# EAGLE design 3003_3pin_voltera (EAGLE 9.6.2)
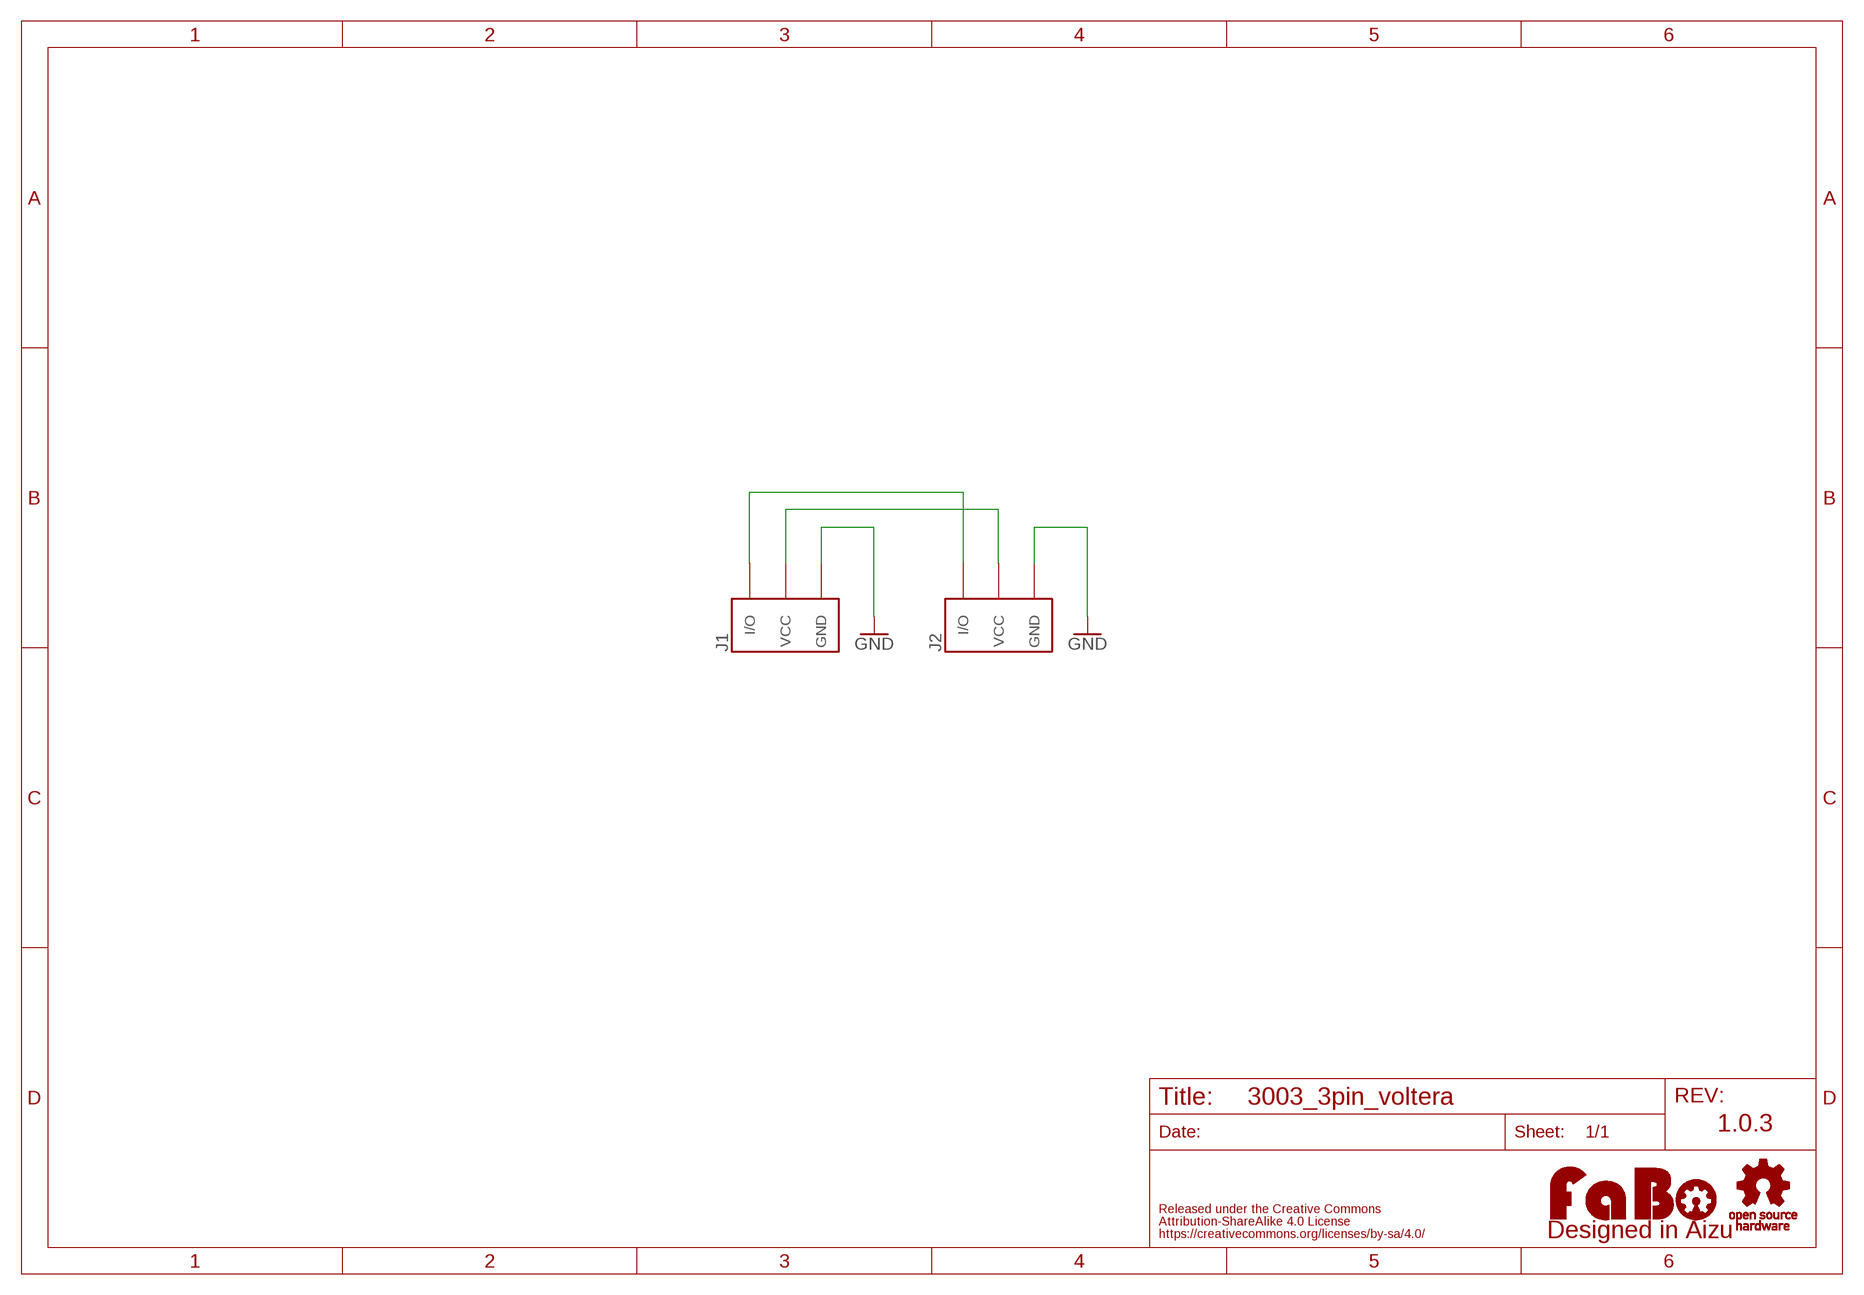
[diagram p0: schematic, sheet 1]

## Parts
J1  FABO_BRICK_3PIN-VOLTERA_BASE  [FABO_BRICK_3PIN_VOLTERA_BASE]
J2  FABO_BRICK_3PIN-VOLTERA_PAD  [FABO_BRICK_3PIN_VOLTERA_PAD]
U$3  LOGO_OSHW-M_BOTTOM  [LOGO_OSHW_M_BOTTOM]
U$4  LOGO_FABO-S  [LOGO_FABO_S]

## Nets
GND: J1.GND J2.GND
N$1: J1.VCC J2.VCC
N$2: J1.I/O J2.I/O

## Notes on the sheet
- 1.0.3

## Library data of the parts
J1 J2 = FaBo-Template:FABO_BRICK_3PIN: FaBo Brick 3pin
U$3 = FaBo-Logo:LOGO_OSHW
U$4 = FaBo-Logo:LOGO_FABO

## Board
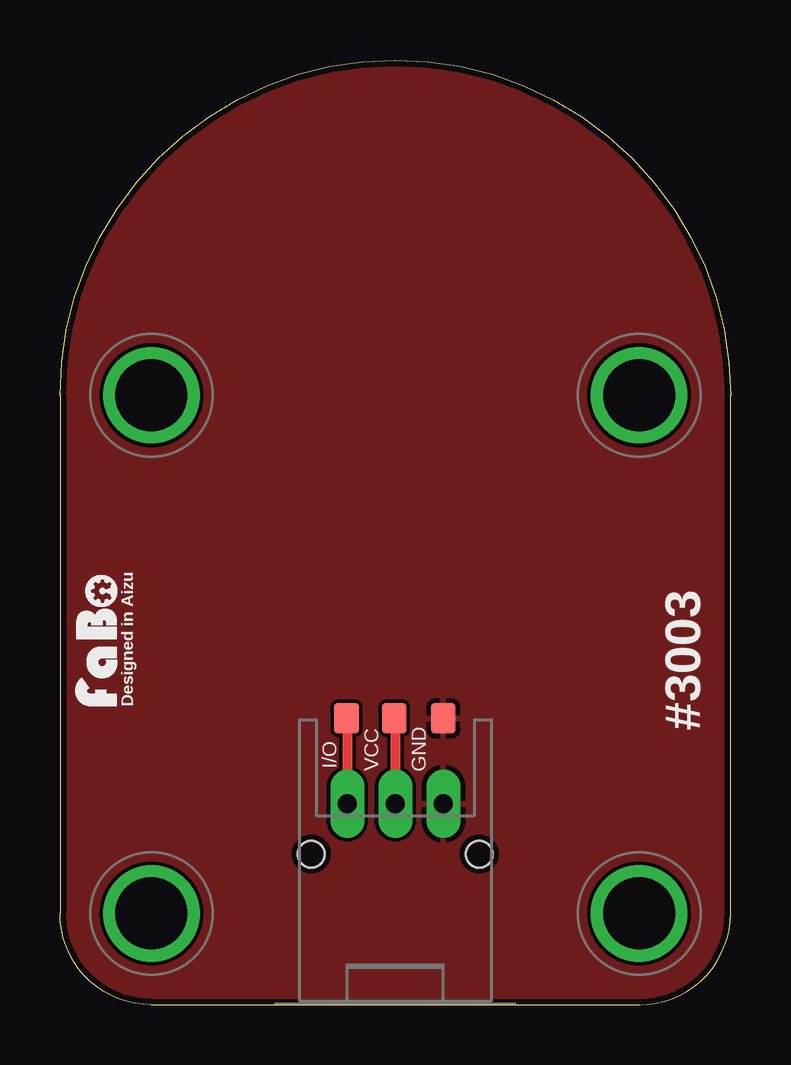
[diagram p1: board, top side]
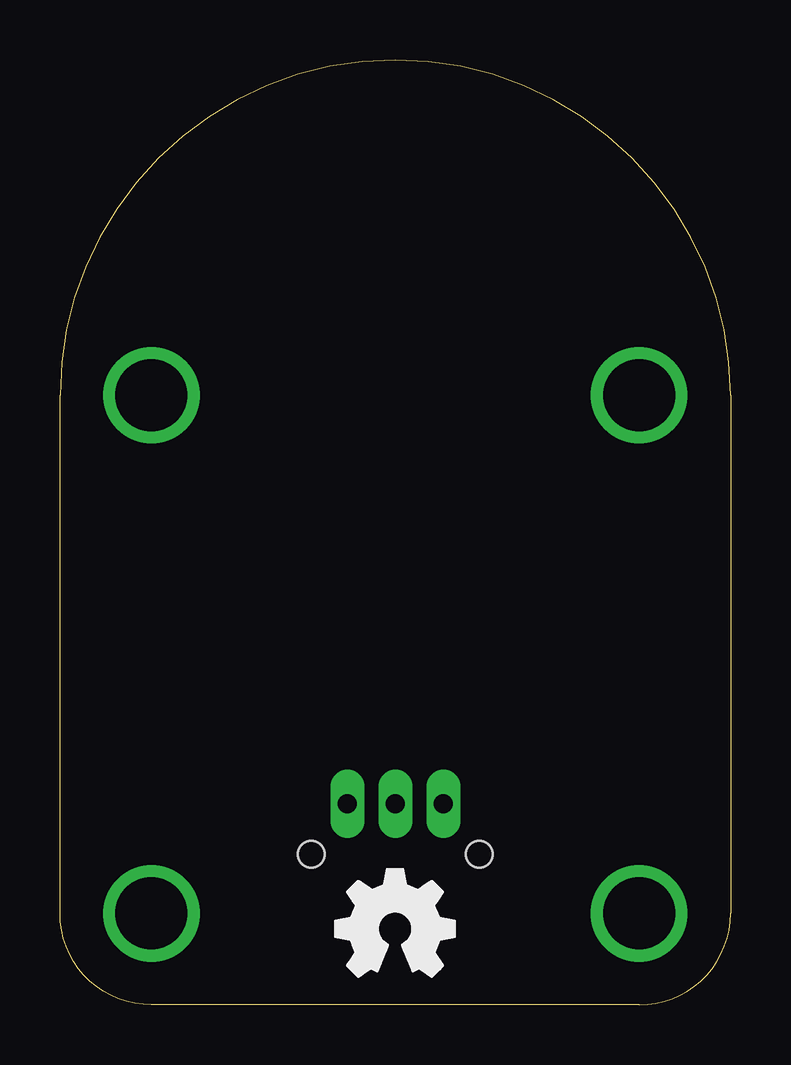
[diagram p2: board, bottom side, seen from below]

Size 27.94 x 39.37 mm. Coordinates in mm from the lower left corner, seen from the top.
Copper layers (1*16): Top 0.035mm / dielectric 1.6mm / Bottom 0.035mm
Design rules "PCBway": minimum track width 6mil, minimum drill 12mil, track to track 6mil, track to pad 6mil, pad to pad 6mil, via to via 6mil, smd to smd 6mil, copper to edge 10mil, drill to drill 10mil, minimum pad ring 10mil, minimum via ring 6mil, stop-mask expansion 2mil, vias tented up to drill 100mil, thermal gap 8mil

### Footprints (pad centres in the part's own frame; a part is rotated, then mirrored left to right if it is on the bottom)
FABO_BRICK_3PIN_VOLTERA_BASE = drill 0.8 pad 1.422 long: GND 2,-6.858; I/O -2,-6.858; VCC 0,-6.858 | drill 3 pad 3.81: P$1 -10.16,10.16; P$2 10.16,10.16; P$3 -10.16,-11.43; P$4 10.16,-11.43 | hole 1.1: -3.5,-8.958; 3.5,-8.958
FABO_BRICK_3PIN_VOLTERA_PAD = smd 1.016 x 1.27: GND 2.007,-3.302; I/O -2.032,-3.302; VCC -0.051,-3.302

### Placement (x,y rotation side)
J1  13.97,15.24 0 top
J2  13.97,15.24 0 top
U$3  13.97,3.17 0 top
U$4  2.54,15.24 90 top

### Tracks (layer width: path | path; a pad name or v marks a point on that pad's centre or on a via)
GND
  pour Top: 0,0 27.94,0 27.94,39.37 0,39.37
N$1
  Top 0.406: J2.VCC 13.97,11.89 J1.VCC
N$2
  Top 0.406: J2.I/O 11.97,11.91 J1.I/O

### Text on the board
tPlace: Designed in Aizu | #3003